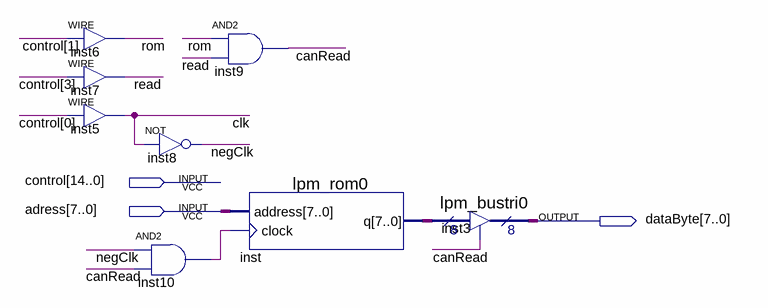
[diagram p0: schematic sheet]
// Quartus schematic Rom.bdf as structural Verilog: 8 symbols, 3 pins
module Rom (
  input  [14:0] control,
  input  [7:0] adress,
  output [7:0] dataByte
);

  wire canRead, clk, inst10_out, negClk, read, rom;
  wire [7:0] inst_q;

  assign rom = control[1];  // WIRE inst6
  assign read = control[3];  // WIRE inst7
  assign clk = control[0];  // WIRE inst5
  not inst8 (negClk, clk);
  and inst10 (inst10_out, negClk, canRead);
  and inst9 (canRead, rom, read);
  lpm_rom0 inst (.address(adress), .clock(inst10_out), .q(inst_q));
  lpm_bustri0 inst3 (.enabledt(canRead), .data(inst_q), .tridata(dataByte));
endmodule
